# EasyEDA Pro project ProProject_【ART-Pi】【FOC】无刷电机驱动器ODrive-AP0.3_2024-06-29.epro, schematic 【ART-Pi】【FOC】无刷电机驱动器ODrive AP0.3_1

## Sheets
1 Controller
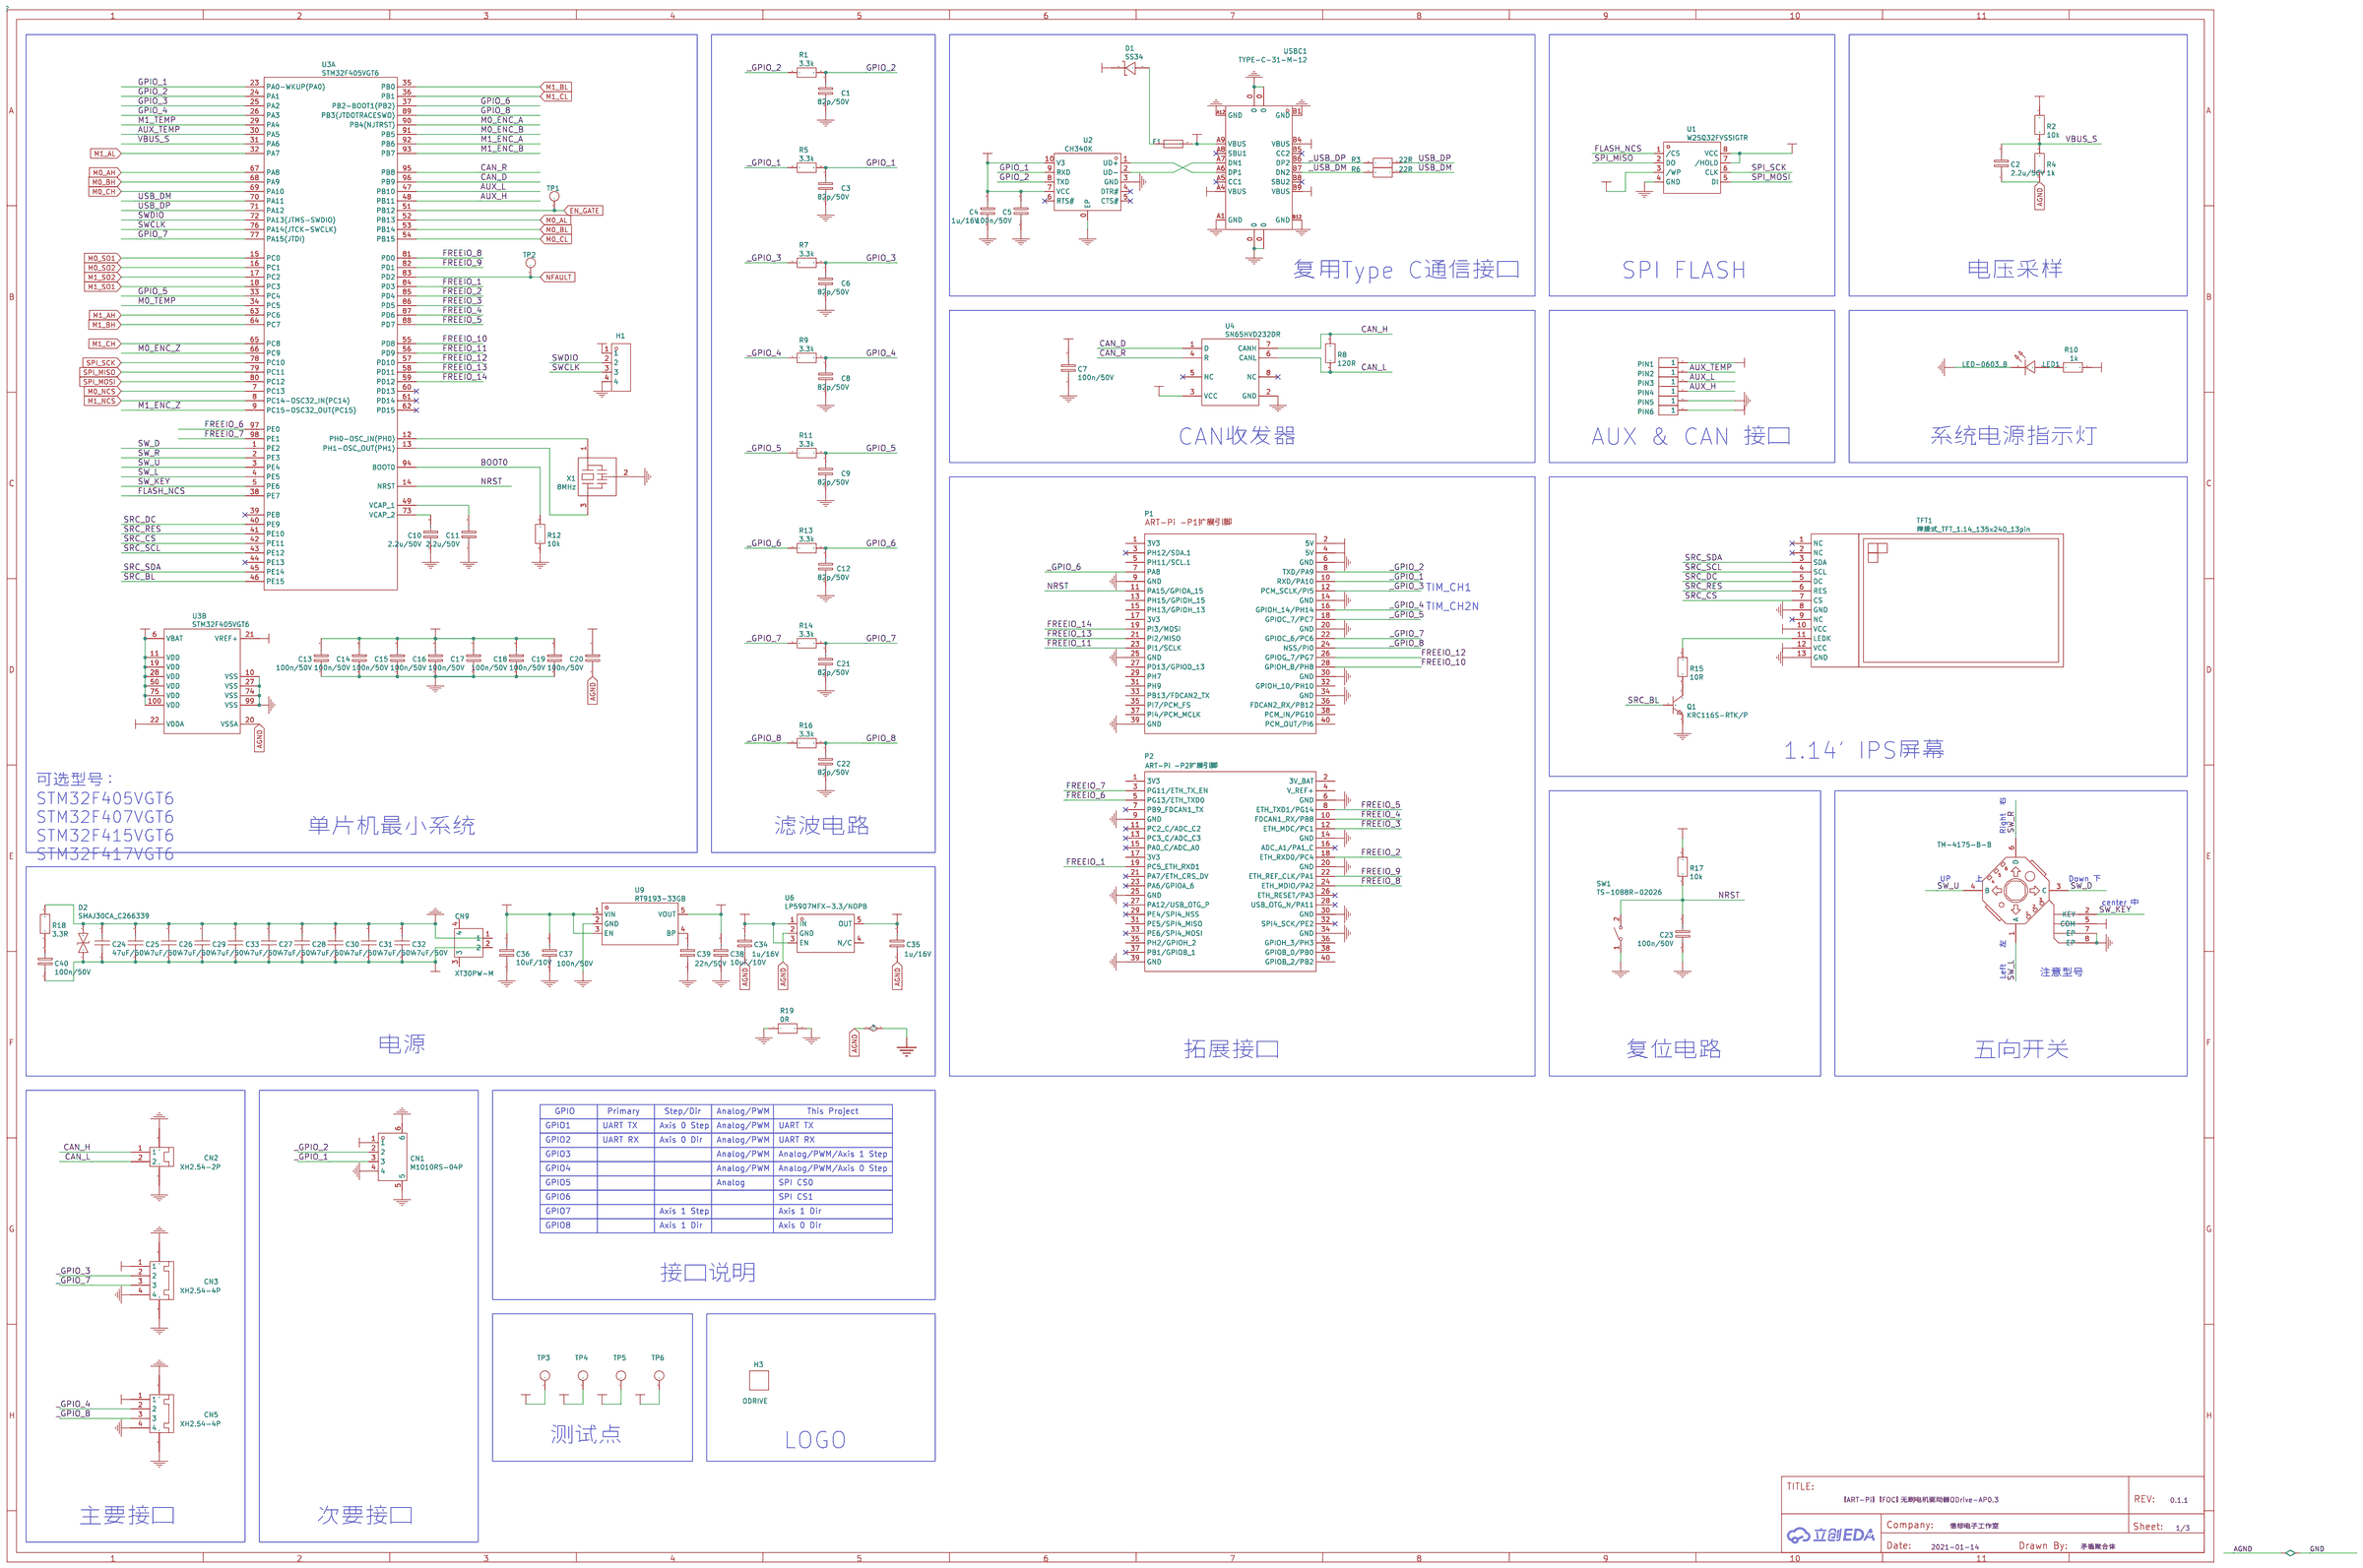
[diagram p3: Controller]
2 M0_Motor
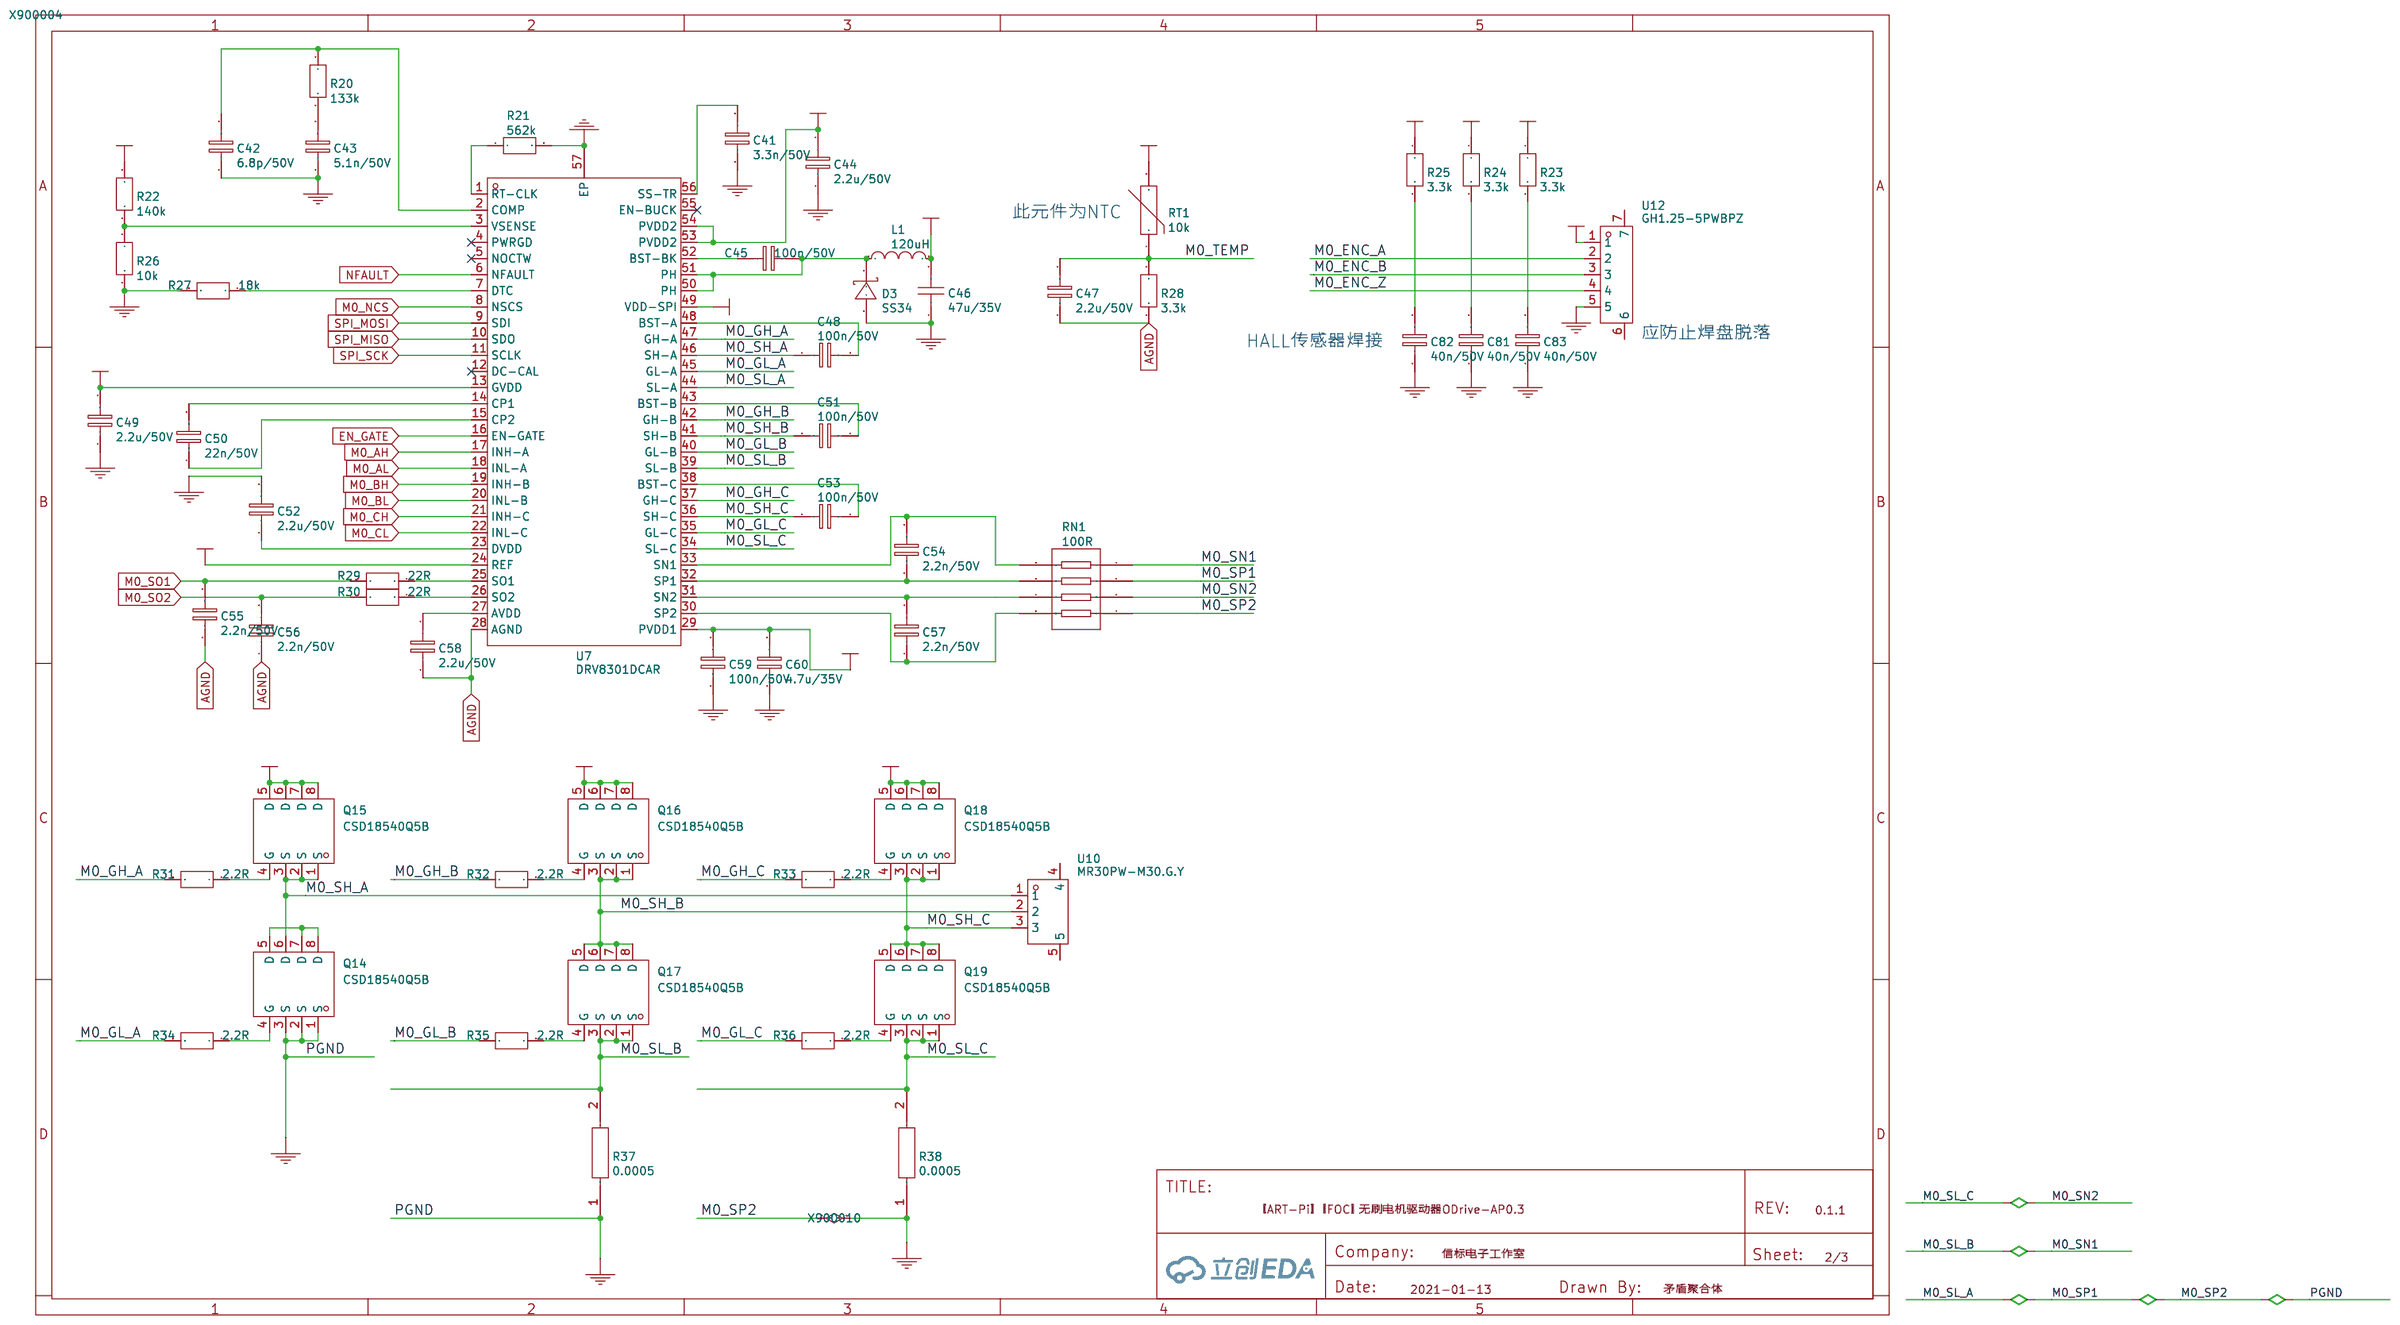
[diagram p4: M0_Motor]
3 M1_Motor
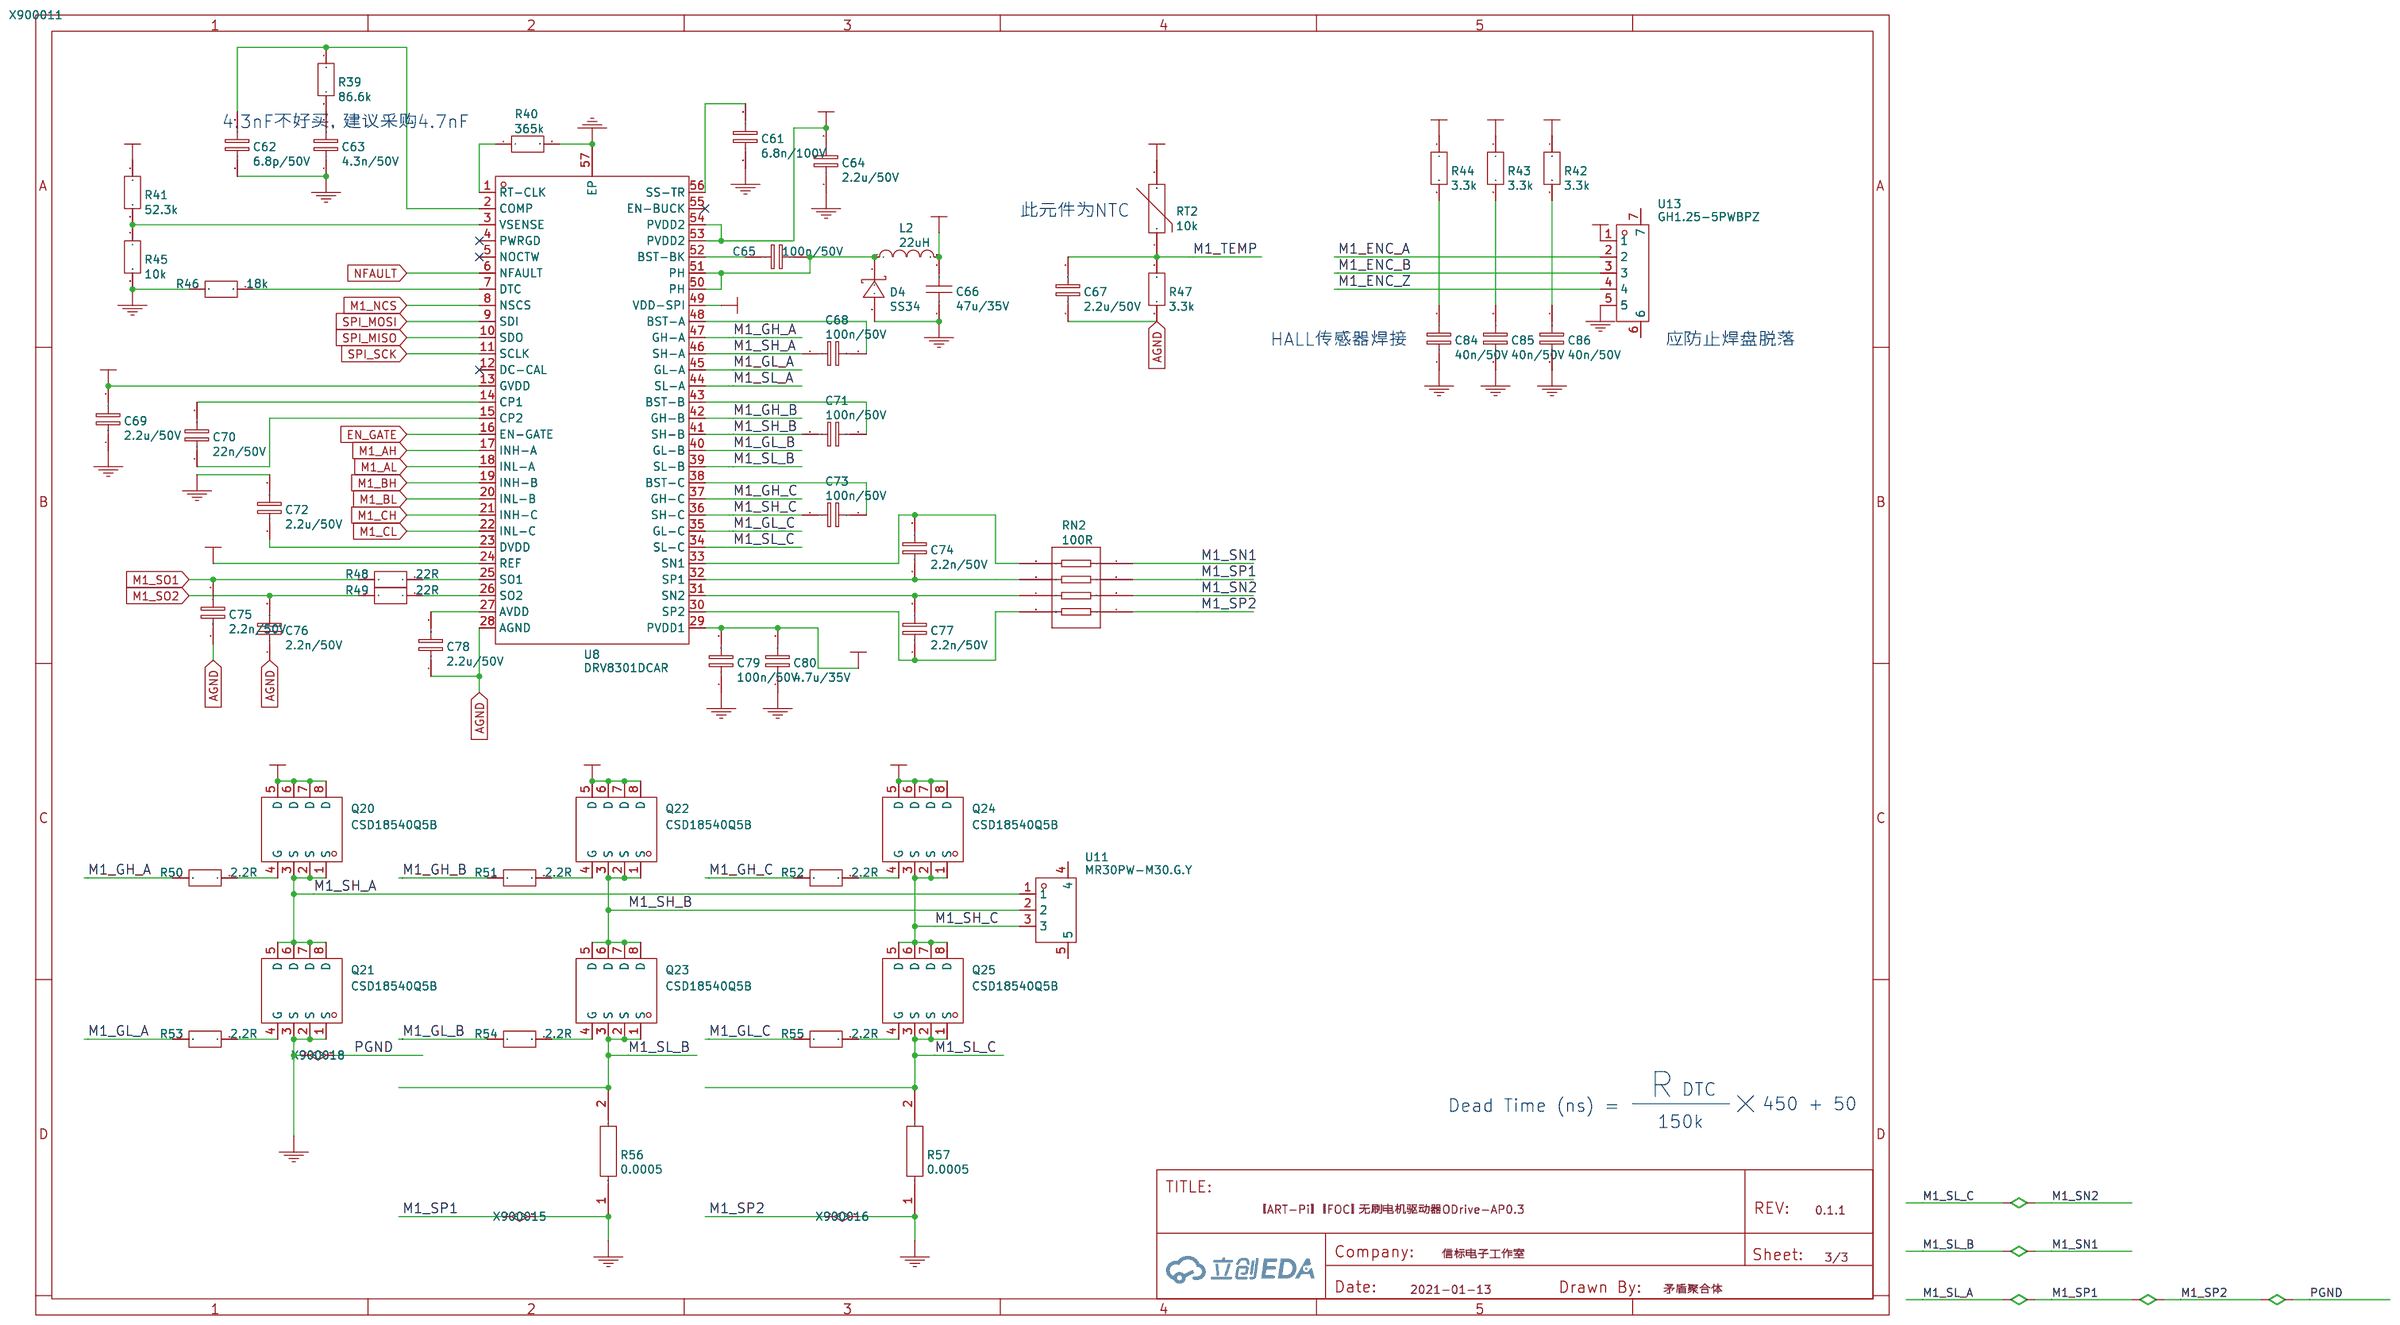
[diagram p5: M1_Motor]

## Parts
sheet Controller
C1  82p/50V  [C0603]
C2  2.2u/50V  [C0603]
C3  82p/50V  [C0603]
C4  1u/16V  [C0603]
C5  100n/50V  [C0603]
C6  82p/50V  [C0603]
C7  100n/50V  [C0603]
C8  82p/50V  [C0603]
C9  82p/50V  [C0603]
C10  2.2u/50V  [C0603]
C11  2.2u/50V  [C0603]
C12  82p/50V  [C0603]
C13  100n/50V  [C0603]
C14  100n/50V  [C0603]
C15  100n/50V  [C0603]
C16  100n/50V  [C0603]
C17  100n/50V  [C0603]
C18  100n/50V  [C0603]
C19  100n/50V  [C0603]
C20  100n/50V  [C0603]
C21  82p/50V  [C0603]
C22  82p/50V  [C0603]
C23  100n/50V  [C0603]
C24  47uF/50V  [C1812]
C25  47uF/50V  [C1812]
C26  47uF/50V  [C1812]
C27  47uF/50V  [C1812]
C28  47uF/50V  [C1812]
C29  47uF/50V  [C1812]
C30  47uF/50V  [C1812]
C31  47uF/50V  [C1812]
C32  47uF/50V  [C1812]
C33  47uF/50V  [C1812]
C34  1u/16V  [C0603]
C35  1u/16V  [C0603]
C36  10uF/10V  [C0603]
C37  100n/50V  [C0603]
C38  10uF/10V  [C0603]
C39  22n/50V  [C0603]
C40  100n/50V  [C0603]
CN1  M1010RS-04P  [CONN-SMD_M1010RS-04P]
CN2  XH2.54-2P  [CONN-SMD_2.54-2P-WT]
CN3  XH2.54-4P  [CONN-SMD_2.54-4P-WT]
CN5  XH2.54-4P  [CONN-SMD_2.54-4P-WT]
CN9  XT30PW-M  [CONN-TH_XT30PW-M]
D1  SS34  [SMA_L4.4-W2.8-LS5.4-RD]
D2  SMAJ30CA_C266339  [SMA_L4.4-W2.6-LS5.0-BI]
F1  FSMD012-1206-R  [F1206]
H1  PZ200V-11-04P  [HDR-TH_4P-P2.00-V-M]  (no BOM)
H3  ODRIVE  [ODRIVE_LOGO_H3.5]  (no BOM)
KEY  TM-4175-B-B  [SW-SMD_TM-4175-B-B]
LED1  LED-0603_B  [LED0603_BLUE]
P1  ART-Pi -P1扩展引脚  [MY_HDR-TH_40P-P2.54-V-M-R2-C20-S2.54]
P2  ART-Pi -P2扩展引脚  [MY_HDR-TH_40P-P2.54-V-M-R2-C20-S2.54]
PIN1  1PIN  [1PIN]  (no BOM)
PIN2  1PIN  [1PIN]  (no BOM)
PIN3  1PIN  [1PIN]  (no BOM)
PIN4  1PIN  [1PIN]  (no BOM)
PIN5  1PIN  [1PIN]  (no BOM)
PIN6  1PIN  [1PIN]  (no BOM)
Q1  KRC116S-RTK/P  [SOT-23-3_L2.9-W1.6-P1.90-LS2.8-BR]
R1  3.3k  [R0603]
R2  10k  [R0603]
R3  22R  [R0603]
R4  1k  [R0603]
R5  3.3k  [R0603]
R6  22R  [R0603]
R7  3.3k  [R0603]
R8  120R  [R0603]
R9  3.3k  [R0603]
R10  1k  [R0603]
R11  3.3k  [R0603]
R12  10k  [R0603]
R13  3.3k  [R0603]
R14  3.3k  [R0603]
R15  10R  [R0603]
R16  3.3k  [R0603]
R17  10k  [R0603]
R18  3.3R  [R0603]
R19  0R  [R0603]
SW1  TS-1088R-02026  [SW-SMD_L3.9-W3.0-P4.45]
TFT1  焊接式_TFT_1.14_135x240_13pin  [焊接式_TFT_1.14_135X240_13PIN]
TP1  Testpoint 1.6mm  [TESTPOINT 1.6MM]  (no BOM)
TP2  Testpoint 1.6mm  [TESTPOINT 1.6MM]  (no BOM)
TP3  Testpoint 1.6mm  [TESTPOINT 1.6MM]  (no BOM)
TP4  Testpoint 1.6mm  [TESTPOINT 1.6MM]  (no BOM)
TP5  Testpoint 1.6mm  [TESTPOINT 1.6MM]  (no BOM)
TP6  Testpoint 1.6mm  [TESTPOINT 1.6MM]  (no BOM)
U1  W25Q32FVSSIGTR  [SOIC-8_L5.3-W5.3-P1.27-LS8.0-BL]
U2  CH340K  [ESOP-10_L4.9-W3.9-P1.00-LS6.2-BL-EP]
U3  STM32F405VGT6  [LQFP-100_L14.0-W14.0-P0.50-LS16.0-BL]  (sections 1,2)
U4  SN65HVD232DR  [SOIC-8_L5.0-W4.0-P1.27-LS6.0-BL]
U6  LP5907MFX-3.3/NOPB  [SOT-23-5_L3.0-W1.7-P0.95-LS2.8-BR]
U9  RT9193-33GB  [SOT-23-5_L3.0-W1.7-P0.95-LS2.8-BR]
USBC1  TYPE-C-31-M-12  [USB-C_SMD-TYPE-C-31-M-12]
X1  8MHz  [OSC-SMD_3P-L3.2-W1.3-P1.2-L]
sheet M0_Motor
C41  3.3n/50V  [C0603]
C42  6.8p/50V  [C0603]
C43  5.1n/50V  [C0603]
C44  2.2u/50V  [C0603]
C45  100n/50V  [C0603]
C46  47u/35V  [C1812]
C47  2.2u/50V  [C0603]
C48  100n/50V  [C0603]
C49  2.2u/50V  [C0603]
C50  22n/50V  [C0603]
C51  100n/50V  [C0603]
C52  2.2u/50V  [C0603]
C53  100n/50V  [C0603]
C54  2.2n/50V  [C0603]
C55  2.2n/50V  [C0603]
C56  2.2n/50V  [C0603]
C57  2.2n/50V  [C0603]
C58  2.2u/50V  [C0603]
C59  100n/50V  [C0603]
C60  4.7u/35V  [C0603]
C81  40n/50V  [C0603]
C82  40n/50V  [C0603]
C83  40n/50V  [C0603]
D3  SS34  [SMA_L4.4-W2.8-LS5.4-RD]
L1  120uH  [IND-SMD_L6.0-W6.0]
Q14  CSD18540Q5B  [VSON-CLIP-8_L5.0-W6.0-P1.27-BL]
Q15  CSD18540Q5B  [VSON-CLIP-8_L5.0-W6.0-P1.27-BL]
Q16  CSD18540Q5B  [VSON-CLIP-8_L5.0-W6.0-P1.27-BL]
Q17  CSD18540Q5B  [VSON-CLIP-8_L5.0-W6.0-P1.27-BL]
Q18  CSD18540Q5B  [VSON-CLIP-8_L5.0-W6.0-P1.27-BL]
Q19  CSD18540Q5B  [VSON-CLIP-8_L5.0-W6.0-P1.27-BL]
R20  133k  [R0603]
R21  562k  [R0603]
R22  140k  [R0603]
R23  3.3k  [R0603]
R24  3.3k  [R0603]
R25  3.3k  [R0603]
R26  10k  [R0603]
R27  18k  [R0603]
R28  3.3k  [R0603]
R29  22R  [R0603]
R30  22R  [R0603]
R31  2.2R  [R0603]
R32  2.2R  [R0603]
R33  2.2R  [R0603]
R34  2.2R  [R0603]
R35  2.2R  [R0603]
R36  2.2R  [R0603]
R37  0.0005  [R2512]
R38  0.0005  [R2512]
RN1  100R  [RES-ARRAY-SMD_0603-8P-L3.2-W1.6-BL]
RT1  10k  [R0603]
U7  DRV8301DCAR  [HTSSOP-56_L14.0-W6.0-P0.50-LS8.0-BL]
U10  MR30PW-M30.G.Y  [CONN-TH_3P-P3.50_MR30PW-M30-G-Y]
U12  GH1.25-5PWBPZ  [CONN-SMD_5P-P1.25_GH1.25-5PWBPZ]
sheet M1_Motor
C61  6.8n/100V  [C0603]
C62  6.8p/50V  [C0603]
C63  4.3n/50V  [C0603]
C64  2.2u/50V  [C0603]
C65  100n/50V  [C0603]
C66  47u/35V  [C1812]
C67  2.2u/50V  [C0603]
C68  100n/50V  [C0603]
C69  2.2u/50V  [C0603]
C70  22n/50V  [C0603]
C71  100n/50V  [C0603]
C72  2.2u/50V  [C0603]
C73  100n/50V  [C0603]
C74  2.2n/50V  [C0603]
C75  2.2n/50V  [C0603]
C76  2.2n/50V  [C0603]
C77  2.2n/50V  [C0603]
C78  2.2u/50V  [C0603]
C79  100n/50V  [C0603]
C80  4.7u/35V  [C0603]
C84  40n/50V  [C0603]
C85  40n/50V  [C0603]
C86  40n/50V  [C0603]
D4  SS34  [SMA_L4.4-W2.8-LS5.4-RD]
L2  22uH  [IND-SMD_L6.0-W6.0]
Q20  CSD18540Q5B  [VSON-CLIP-8_L5.0-W6.0-P1.27-BL]
Q21  CSD18540Q5B  [VSON-CLIP-8_L5.0-W6.0-P1.27-BL]
Q22  CSD18540Q5B  [VSON-CLIP-8_L5.0-W6.0-P1.27-BL]
Q23  CSD18540Q5B  [VSON-CLIP-8_L5.0-W6.0-P1.27-BL]
Q24  CSD18540Q5B  [VSON-CLIP-8_L5.0-W6.0-P1.27-BL]
Q25  CSD18540Q5B  [VSON-CLIP-8_L5.0-W6.0-P1.27-BL]
R39  86.6k  [R0603]
R40  365k  [R0603]
R41  52.3k  [R0603]
R42  3.3k  [R0603]
R43  3.3k  [R0603]
R44  3.3k  [R0603]
R45  10k  [R0603]
R46  18k  [R0603]
R47  3.3k  [R0603]
R48  22R  [R0603]
R49  22R  [R0603]
R50  2.2R  [R0603]
R51  2.2R  [R0603]
R52  2.2R  [R0603]
R53  2.2R  [R0603]
R54  2.2R  [R0603]
R55  2.2R  [R0603]
R56  0.0005  [R2512]
R57  0.0005  [R2512]
RN2  100R  [RES-ARRAY-SMD_0603-8P-L3.2-W1.6-BL]
RT2  10k  [R0603]
U8  DRV8301DCAR  [HTSSOP-56_L14.0-W6.0-P0.50-LS8.0-BL]
U11  MR30PW-M30.G.Y  [CONN-TH_3P-P3.50_MR30PW-M30-G-Y]
U13  GH1.25-5PWBPZ  [CONN-SMD_5P-P1.25_GH1.25-5PWBPZ]

## Library data of the parts
C1 C3 C6 C8 C9 C12 C21 C22 = 82p/50V: Manufacturer Part: CC0603GRNPO0BN820; Supplier: LCSC; Manufacturer: YAGEO; Supplier Part: C576792
C2 C44 C47 C49 C52 C58 C64 C67 C69 C72 C78 = 2.2u/50V: Manufacturer Part: GRM188R61H225KE11D; Supplier Part: C162273; Manufacturer: Murata Electronics; Supplier: LCSC
C4 = 1u/16V: Manufacturer Part: CL10A105KO8NNNC; Supplier: LCSC; Manufacturer: SAMSUNG; Supplier Part: C1592
C5 C13-C20 C23 = 100n/50V: Manufacturer Part: CC0603KRX7R9BB104; Supplier: LCSC; Manufacturer: YAGEO; Supplier Part: C14663
C7 C37 C40 = 100n/50V: Supplier Part: C14663; Supplier: LCSC; Manufacturer Part: CC0603KRX7R9BB104; Manufacturer: YAGEO
C10 C11 = 2.2u/50V: Manufacturer Part: GRM188R61H225KE11D; Supplier: LCSC; Manufacturer: Murata Electronics; Supplier Part: C162273
C24-C33 = 47uF/50V
C34 C35 = 1u/16V: Supplier Part: C1592; Supplier: LCSC; Manufacturer Part: CL10A105KO8NNNC; Manufacturer: SAMSUNG
C36 C38 = 10uF/10V: Supplier Part: C85713; Supplier: LCSC; Manufacturer Part: CL10A106MP8NNNC; Manufacturer: SAMSUNG
C39 = 22n/50V: Supplier Part: C21122; Supplier: LCSC; Manufacturer Part: CL10B223KB8NNNC; Manufacturer: SAMSUNG
CN1 = M1010RS-04P: Supplier: LCSC; Supplier Part: C541846; Manufacturer: XFCN
CN2 = XH2.54-2P: Supplier: LCSC; Manufacturer: BOOMELE; Manufacturer Part: XH-5AW; image: //image.lceda.cn/szlcsc/C24023.jpg; Supplier Part: C24023; Paste Type: expand; Assembly Type: manualWeld
CN3 CN5 = XH2.54-4P: Supplier: LCSC; Manufacturer: BOOMELE; Manufacturer Part: XH-5AW; image: //image.lceda.cn/szlcsc/C24023.jpg; Supplier Part: C24023; Paste Type: expand; Assembly Type: manualWeld
CN9 = XT30PW-M: 类别:-;类型1:-;; LCSC Part Name: AMASS(艾迈斯)航模插头 卧式弯脚 XT30PW-M公头; Supplier Part: C431092; Manufacturer: AMASS(艾迈斯); JLCPCB Part Class: 扩展库; Datasheet: https://atta.szlcsc.com/upload/public/pdf/source/20220222/6A9F22F7850E25B33E1BE430ADF8560B.pdf; Supplier: LCSC; Brand: 艾迈斯; Type: 航模插头; RatedVoltage: DC 500V; InterfaceType: 公头; RatedCurrent: 15A; RecommendedWireGauge: 16/18/20AWG; contact resistance: 1.2mΩ; specifications: 2pin
D1 D3 D4 = SS34: Supplier: LCSC; Manufacturer: Yenji; Supplier Part: C142458
D2 = SMAJ30CA_C266339: Supplier: LCSC; Supplier Part: C266339; Manufacturer: Suzhou Good-Ark Elec; Manufacturer Part: SMAJ30CA
F1 = FSMD012-1206-R: Supplier: LCSC; Supplier Part: C220144; Manufacturer: Fuzetec Tech; JLCPCB Part Class: Extend
H1 = PZ200V-11-04P: Supplier: LCSC; Supplier Part: C541858; Manufacturer: XFCN; JLCPCB SMD: Yes; JLCPCB Part Class: Extend
H3 = ODRIVE: Manufacturer Part: Hole-3mm
KEY = TM-4175-B-B: Supplier: LCSC; Manufacturer: HRO; Manufacturer Part: K1-5202UA-01; Supplier Part: C465996
LED1 = LED-0603_B: Manufacturer: EVERLIGHT(台湾亿光); Manufacturer Part: 19-217/BHC-ZL1M2RY/3T; Supplier Part: C72041; Supplier: LCSC
P1 = ART-Pi -P1扩展引脚: Manufacturer: BOOMELE; Manufacturer Part: 2.54mm 2*20PFemale header; Supplier Part: C50982; Supplier: LCSC
P2 = ART-Pi -P2扩展引脚: Manufacturer: BOOMELE; Manufacturer Part: 2.54mm 2*20PFemale header; Supplier Part: C50982; Supplier: LCSC
PIN1-PIN6 = 1PIN
Q1 = KRC116S-RTK/P: Supplier: LCSC; Supplier Part: C125283; Manufacturer: KEC Semicon; JLCPCB Part Class: Extend; JLCPCB SMD: Yes
R1 R5 R7 R9 R11 R13 R14 R16 R23-R25 R28 R42-R44 R47 = 3.3k: Manufacturer Part: 0603WAF3301T5E; Supplier: LCSC; Manufacturer: UniOhm; Supplier Part: C22978
R2 R12 R17 R26 R45 = 10k: Manufacturer Part: RC0603FR-0710KL; Supplier: LCSC; Manufacturer: YAGEO; Supplier Part: C98220
R3 R6 R29 R30 R48 R49 = 22R: Manufacturer Part: ARG03FTC0220; Supplier: LCSC; Manufacturer: Viking Tech; Supplier Part: C217888
R4 R10 = 1k: Manufacturer Part: RT0603FRE071KL; Supplier: LCSC; Manufacturer: YAGEO; Supplier Part: C375503
R8 = 120R: Manufacturer Part: HPCR0603F120RK9; Supplier: LCSC; Manufacturer: ResistorToday; Supplier Part: C365072
R15 = 10R: Manufacturer Part: QR0603J10RP05; Supplier: LCSC; Manufacturer: Ever Ohms Tech; Supplier Part: C176153
R18 = 3.3R: Manufacturer Part: 1206W4F330KT5E; Supplier: LCSC; Manufacturer: UniOhm; Supplier Part: C17945
R19 = 0R: Manufacturer Part: 0603WAJ0000T5E; Supplier: LCSC; Manufacturer: UniOhm; Supplier Part: C15402
SW1 = TS-1088R-02026: Supplier: LCSC; Supplier Part: C455280; Manufacturer: XUNPU; JLCPCB SMD: Yes; JLCPCB Part Class: Extend
TFT1 = 焊接式_TFT_1.14_135x240_13pin
TP1-TP6 = Testpoint 1.6mm
U1 = W25Q32FVSSIGTR: Supplier: LCSC; Manufacturer: WINBOND; Manufacturer Part: W25Q32JVSSIQ; Supplier Part: C82344
U2 = CH340K: Supplier: LCSC; Supplier Part: C968586; Manufacturer: WCH(Jiangsu Qin Heng)
U3 = STM32F405VGT6: tags: STM32; Supplier Part: C56621; Supplier: LCSC; Manufacturer: ST; image: http://image.lceda.cn/szlcsc/C56621.jpg
U4 = SN65HVD232DR: Supplier: LCSC; Manufacturer: TI; image: //image.lceda.cn/szlcsc/C30530.jpg; Supplier Part: C30530; JLCPCB Part Class: Extend; JLCPCB SMD: Yes
U6 = LP5907MFX-3.3/NOPB: Supplier: LCSC; Supplier Part: C80670; Manufacturer: Texas Instruments; JLCPCB Part Class: Extend; JLCPCB SMD: Yes
U9 = RT9193-33GB: Supplier: LCSC; Manufacturer: RICHTEK; Supplier Part: C15651; Paste Type: expand
USBC1 = TYPE-C-31-M-12: Supplier: LCSC; Supplier Part: C165948; Manufacturer: Rectangular Connectors - Contacts
X1 = 8MHz: Supplier: LCSC; Manufacturer: MuRata; Manufacturer Part: CSTCE8M00G52-R0; Supplier Part: C22549
C41 = 3.3n/50V: Manufacturer Part: 0603B332K500NT; Supplier Part: C92203; Manufacturer: FH; Supplier: LCSC
C42 C62 = 6.8p/50V: Manufacturer Part: 0603CG6R8C500NT; Supplier Part: C1679; Manufacturer: FH; Supplier: LCSC
C43 = 5.1n/50V: Manufacturer Part: 0603B512K500NT; Supplier Part: C1587; Manufacturer: FH; Supplier: LCSC
C45 C48 C51 C53 C59 C65 C68 C71 C73 C79 = 100n/50V: Manufacturer Part: CC0603KRX7R9BB104; Supplier Part: C14663; Manufacturer: YAGEO; Supplier: LCSC
C46 C66 = 47u/35V
C50 C70 = 22n/50V: Manufacturer Part: CL10B223KB8NNNC; Supplier Part: C21122; Manufacturer: SAMSUNG; Supplier: LCSC
C54-C57 C74-C77 = 2.2n/50V: Manufacturer Part: 0603B222K500NT; Supplier Part: C1604; Manufacturer: FH; Supplier: LCSC
C60 C80 = 4.7u/35V: Manufacturer Part: CL10A475KL8NRNC; Supplier Part: C307467; Manufacturer: Samsung Electro-Mechanics; Supplier: LCSC
C81-C86 = 40n/50V: Manufacturer Part: 0603B403K500NT; Supplier Part: C41782; Manufacturer: FH; Supplier: LCSC
L1 = 120uH: Supplier: LCSC; Supplier Part: C168096; Manufacturer: Changjiang Microelectronics Tech; Manufacturer Part: FNR6045S121MT
Q14-Q25 = CSD18540Q5B: 类型:1个N沟道;漏源电压(Vdss):60V;连续漏极电流(Id):100A;功率(Pd):3.1W；195W;导通电阻(RDS(on)@Vgs,Id):2.2mΩ@10V,28A;阈值电压(Vgs(th)@Id):2.3V@250uA;; LCSC Part Name: 1个N沟道 耐压:60V 电流:100A; Supplier Part: C86513; Manufacturer: TI(德州仪器); Supplier Footprint: VSON-8(5x6); JLCPCB Part Class: 扩展库; Datasheet: https://www.ti.com/cn/lit/gpn/csd18540q5b; Supplier: LCSC; Type: 1个N沟道; Drain Source Voltage (Vdss): 60V; Continuous Drain Current (Id): 100A; Power Dissipation (Pd): 3.1W；195W; Drain Source On Resistance (RDS(on)@Vgs,Id): 2.2mΩ@10V,28A; Gate Threshold Voltage (Vgs(th)@Id): 2.3V@250uA; Total Gate Charge (Qg@Vgs): 53nC@10V; Input Capacitance (Ciss@Vds): 4.23nF@30V; Operating Temperature: -55℃~+150℃@(Tj)
R20 = 133k: Manufacturer Part: AC0603FR-07133KL; Supplier: LCSC; Manufacturer: YAGEO; Supplier Part: C227577
R21 = 562k: Manufacturer Part: TC0325D5623T5E; Supplier: LCSC; Manufacturer: UniOhm; Supplier Part: C51262
R22 = 140k: Manufacturer Part: RC0603FR-07140KL; Supplier: LCSC; Manufacturer: YAGEO; Supplier Part: C185372
R27 R46 = 18k: Manufacturer Part: ARG03FTC1802; Supplier: LCSC; Manufacturer: Viking Tech; Supplier Part: C217831
R31-R36 R50-R55 = 2.2R: Manufacturer Part: 0603WAJ022JT5E; Supplier: LCSC; Manufacturer: UniOhm; Supplier Part: C25226
R37 R38 R56 R57 = 0.0005: Supplier: LCSC; Supplier Part: C2681067; Manufacturer: RALEC(旺诠); Manufacturer Part: LR2512-23R0005J4
RN1 RN2 = 100R: Supplier: LCSC; Manufacturer: FH; Manufacturer Part: RC-ML08W101JT; Supplier Part: C79203
RT1 RT2 = 10k: Supplier: LCSC; Supplier Part: C524451; Manufacturer: TDK; Manufacturer Part: NTCG164BH103JT1
U7 U8 = DRV8301DCAR: Supplier: LCSC; Supplier Part: C98969; Manufacturer: Texas Instruments; JLCPCB Part Class: Extend; JLCPCB SMD: Yes
U10 U11 = MR30PW-M30.G.Y: LCSC Part Name: MR30PW20三芯PCB 弯插公金黄H=3mm; Supplier Part: C19268036; Manufacturer: AMASS(艾迈斯); JLCPCB Part Class: 扩展库; Datasheet: https://atta.szlcsc.com/upload/public/pdf/source/20231221/E63D24EDC016665263C6304FABBAAC61.pdf; Supplier: LCSC
U12 U13 = GH1.25-5PWBPZ: LCSC Part Name: GH1.25-5P卧贴编带; Supplier Part: C2829254; Manufacturer: BOOMELE(博穆精密); JLCPCB Part Class: 扩展库; Datasheet: https://atta.szlcsc.com/upload/public/pdf/source/20211125/08A09A4909F58AF780B71FE423A00F7E.pdf; Supplier: LCSC
C61 = 6.8n/100V: Manufacturer Part: 0603B682K101NT; Supplier Part: C81355; Manufacturer: FH; Supplier: LCSC
C63 = 4.3n/50V: Manufacturer Part: CC0603KRX7R9BB472; Supplier Part: C106218; Manufacturer: YAGEO; Supplier: LCSC
L2 = 22uH: Supplier: LCSC; Supplier Part: C51349; Manufacturer: Sunlord; Manufacturer Part: SWPA6028S220MT
R39 = 86.6k: Manufacturer Part: RM06FTN8662; Supplier: LCSC; Manufacturer: TA-I Tech; Supplier Part: C188033
R40 = 365k: Manufacturer Part: RC0603FR-07365KL; Supplier: LCSC; Manufacturer: YAGEO; Supplier Part: C185336
R41 = 52.3k: Manufacturer Part: RMC060352.3K1%N; Supplier: LCSC; Manufacturer: Tyohm; Supplier Part: C325624

## Nets
5V: C34.2 C36.2 C37.2 C66.2 CN3.1 CN5.1 D1.1(K) L2.2 P1.2(5V) P1.4(5V) R41.1 TP5.1 U6.1(IN) U6.3(EN) U9.1(VIN) U9.3(EN)
12V: C46.2 L1.2 PIN1.1 R22.1 TP6.1
AVCC: C20.2 C35.2 PIN6.1 RT1.2 RT2.2 TP4.1 U3.21(VREF+) U3.22(VDDA) U6.5(OUT) U7.24(REF) U8.24(REF)
GND: C1.2 C2.1 C3.2 C4.1 C5.1 C6.2 C7.1 C8.2 C9.2 C10.1 C11.1 C12.2 C13.1 C14.1 C15.1 C16.1 C17.1 C18.1 C19.1 C20.1 C21.2 C22.2 C23.1 C34.1 C35.1 C36.1 C37.1 C38.1 C39.1 C42.1 C43.1 C46.1 C47.1 C49.1 C52.2 C55.1 C56.1 C58.1 C62.1 C63.1 C66.1 C67.1 C69.1 C72.2 C75.1 C76.1 C78.1 C81.1 C82.1 C83.1 C84.1 C85.1 C86.1 CN1.4 CN1.5 CN1.6 CN2.0 CN3.0 CN3.4 CN5.0 CN5.4 D3.2(A) D4.2(A) H1.4 KEY.7(EP) KEY.8(EP) LED1.2 P1.6(GND) P1.9(GND) P1.14(GND) P1.20(GND) P1.25(GND) P1.30(GND) P1.34(GND) P1.39(GND) P2.6(GND) P2.9(GND) P2.14(GND) P2.20(GND) P2.25(GND) P2.30(GND) P2.34(GND) P2.39(GND) PIN5.1 Q1.2(E) R4.2 R12.2 R19.2 R21.2 R26.2 R27.2 R28.2 R40.2 R45.2 R46.2 R47.2 SW1.1 TFT1.8(GND) TFT1.13(GND) U1.4(GND) U2.0(EP) U2.3(GND) U3.10(VSS) U3.20(VSSA) U3.27(VSS) U3.74(VSS) U3.99(VSS) U4.2(GND) U6.2(GND) U7.28(AGND) U7.57(EP) U8.28(AGND) U8.57(EP) U9.2(GND) U12.5 U13.5 USBC1.0 USBC1.A1(GND) USBC1.A12(GND) USBC1.B1(GND) USBC1.B12(GND) X1.2(VSS)
PGND: C24.2 C25.2 C26.2 C27.2 C28.2 C29.2 C30.2 C31.2 C32.2 C33.2 C41.1 C44.1 C59.1 C60.1 C61.1 C64.1 C79.1 C80.1 CN9.1 D2.2 Q14.1(S) Q14.2(S) Q14.3(S) Q21.1(S) Q21.2(S) Q21.3(S) R18.1 R19.1 R37.1 R38.1 R56.1 R57.1 RN1.1 RN1.3 RN2.1 RN2.3 U7.44(SL-A) U8.44(SL-A)
VBUS_S: C2.2 R2.2 R4.1 U3.31(PA6)
VCC: C4.2 C5.2 C7.2 C13.2 C14.2 C15.2 C16.2 C17.2 C18.2 C19.2 C38.2 CN1.1 H1.1 KEY.5(COM) R10.1 R17.1 R23.1 R24.1 R25.1 R42.1 R43.1 R44.1 TFT1.10(VCC) TFT1.12(VCC) TP3.1 U1.3(/WP) U1.7(/HOLD) U1.8(VCC) U2.7(VCC) U2.10(V3) U3.6(VBAT) U3.11(VDD) U3.19(VDD) U3.28(VDD) U3.50(VDD) U3.75(VDD) U3.100(VDD) U4.3(VCC) U7.49(VDD-SPI) U8.49(VDD-SPI) U9.5(VOUT) U12.1 U13.1
_GPIO_1: CN1.3 P1.10(RXD/PA10) R5.1
_GPIO_2: CN1.2 P1.8(TXD/PA9) R1.1
_GPIO_3: CN3.2 P1.12(PCM_SCLK/PI5) R7.1
_GPIO_4: CN5.2 P1.16(GPIOH_14/PH14) R9.1
_GPIO_5: P1.18(GPIOC_7/PC7) R11.1
_GPIO_6: P1.7(PA8) R13.1
_GPIO_7: CN3.3 P1.22(GPIOC_6/PC6) R14.1
_GPIO_8: CN5.3 P1.24(NSS/PI0) R16.1
_USB_DM: R6.2 USBC1.B7(DN2)
_USB_DP: R3.2 USBC1.B6(DP2)
AUX_H: PIN4.1 U3.48(PB11)
AUX_L: PIN3.1 U3.47(PB10)
AUX_TEMP: PIN2.1 U3.30(PA5)
BOOT0: R12.1 U3.94(BOOT0)
CAN_D: U3.96(PB9) U4.1(D)
CAN_H: CN2.1 R8.1 U4.7(CANH)
CAN_L: CN2.2 R8.2 U4.6(CANL)
CAN_R: U3.95(PB8) U4.4(R)
DCBUS: C24.1 C25.1 C26.1 C27.1 C28.1 C29.1 C30.1 C31.1 C32.1 C33.1 C40.2 C44.2 C59.2 C60.2 C64.2 C79.2 C80.2 CN9.2 D2.1 Q15.5(D) Q15.6(D) Q15.7(D) Q15.8(D) Q16.5(D) Q16.6(D) Q16.7(D) Q16.8(D) Q18.5(D) Q18.6(D) Q18.7(D) Q18.8(D) Q20.5(D) Q20.6(D) Q20.7(D) Q20.8(D) Q22.5(D) Q22.6(D) Q22.7(D) Q22.8(D) Q24.5(D) Q24.6(D) Q24.7(D) Q24.8(D) R2.1 U7.29(PVDD1) U7.53(PVDD2) U7.54(PVDD2) U8.29(PVDD1) U8.53(PVDD2) U8.54(PVDD2)
EN_GATE: TP1.1 U3.51(PB12) U7.16(EN-GATE) U8.16(EN-GATE)
FLASH_NCS: U1.1(/CS) U3.38(PE7)
FREEIO_1: P2.19(PC5_ETH_RXD1) U3.84(PD3)
FREEIO_2: P2.18(ETH_RXD0/PC4) U3.85(PD4)
FREEIO_3: P2.12(ETH_MDC/PC1) U3.86(PD5)
FREEIO_4: P2.10(FDCAN1_RX/PB8) U3.87(PD6)
FREEIO_5: P2.8(ETH_TXD1/PG14) U3.88(PD7)
FREEIO_6: P2.5(PG13/ETH_TXD0) U3.97(PE0)
FREEIO_7: P2.3(PG11/ETH_TX_EN) U3.98(PE1)
FREEIO_8: P2.24(ETH_MDIO/PA2) U3.81(PD0)
FREEIO_9: P2.22(ETH_REF_CLK/PA1) U3.82(PD1)
FREEIO_10: P1.28(GPIOH_8/PH8) U3.55(PD8)
FREEIO_11: P1.23(PI1/SCLK) U3.56(PD9)
FREEIO_12: P1.26(GPIOG_7/PG7) U3.57(PD10)
FREEIO_13: P1.21(PI2/MISO) U3.58(PD11)
FREEIO_14: P1.19(PI3/MOSI) U3.59(PD12)
GPIO_1: C3.1 R5.2 U2.9(RXD) U3.23(PA0-WKUP(PA0))
GPIO_2: C1.1 R1.2 U2.8(TXD) U3.24(PA1)
GPIO_3: C6.1 R7.2 U3.25(PA2)
GPIO_4: C8.1 R9.2 U3.26(PA3)
GPIO_5: C9.1 R11.2 U3.33(PC4)
GPIO_6: C12.1 R13.2 U3.37(PB2-BOOT1(PB2))
GPIO_7: C21.1 R14.2 U3.77(PA15(JTDI))
GPIO_8: C22.1 R16.2 U3.89(PB3(JTDOTRACESWO))
GVDD: C49.2 U7.13(GVDD)
GVDD2: C69.2 U8.13(GVDD)
M0_AH: U3.67(PA8) U7.17(INH-A)
M0_AL: U3.52(PB13) U7.18(INL-A)
M0_BH: U3.68(PA9) U7.19(INH-B)
M0_BL: U3.53(PB14) U7.20(INL-B)
M0_CH: U3.69(PA10) U7.21(INH-C)
M0_CL: U3.54(PB15) U7.22(INL-C)
M0_ENC_A: C83.2 R23.2 U3.90(PB4(NJTRST)) U12.2
M0_ENC_B: C81.2 R24.2 U3.91(PB5) U12.3
M0_ENC_Z: C82.2 R25.2 U3.66(PC9) U12.4
M0_GH_A: R31.2 U7.47(GH-A)
M0_GH_B: R32.2 U7.42(GH-B)
M0_GH_C: R33.2 U7.37(GH-C)
M0_GL_A: R34.2 U7.45(GL-A)
M0_GL_B: R35.2 U7.40(GL-B)
M0_GL_C: R36.2 U7.35(GL-C)
M0_NCS: U3.7(PC13) U7.8(NSCS)
M0_SH_A: C48.1 Q14.5(D) Q14.6(D) Q14.7(D) Q14.8(D) Q15.1(S) Q15.2(S) Q15.3(S) U7.46(SH-A) U10.1
M0_SH_B: C51.1 Q16.1(S) Q16.2(S) Q16.3(S) Q17.5(D) Q17.6(D) Q17.7(D) Q17.8(D) U7.41(SH-B) U10.2
M0_SH_C: C53.1 Q18.1(S) Q18.2(S) Q18.3(S) Q19.5(D) Q19.6(D) Q19.7(D) Q19.8(D) U7.36(SH-C) U10.3
M0_SL_B: Q17.1(S) Q17.2(S) Q17.3(S) R37.2 RN1.4 U7.39(SL-B)
M0_SL_C: Q19.1(S) Q19.2(S) Q19.3(S) R38.2 RN1.2 U7.34(SL-C)
M0_SO1: C55.2 R29.2 U3.15(PC0)
M0_SO2: C56.2 R30.2 U3.16(PC1)
M0_TEMP: C47.2 R28.1 RT1.1 U3.34(PC5)
M1_AH: U3.63(PC6) U8.17(INH-A)
M1_AL: U3.32(PA7) U8.18(INL-A)
M1_BH: U3.64(PC7) U8.19(INH-B)
M1_BL: U3.35(PB0) U8.20(INL-B)
M1_CH: U3.65(PC8) U8.21(INH-C)
M1_CL: U3.36(PB1) U8.22(INL-C)
M1_ENC_A: C86.2 R42.2 U3.92(PB6) U13.2
M1_ENC_B: C85.2 R43.2 U3.93(PB7) U13.3
M1_ENC_Z: C84.2 R44.2 U3.9(PC15-OSC32_OUT(PC15)) U13.4
M1_GH_A: R50.2 U8.47(GH-A)
M1_GH_B: R51.2 U8.42(GH-B)
M1_GH_C: R52.2 U8.37(GH-C)
M1_GL_A: R53.2 U8.45(GL-A)
M1_GL_B: R54.2 U8.40(GL-B)
M1_GL_C: R55.2 U8.35(GL-C)
M1_NCS: U3.8(PC14-OSC32_IN(PC14)) U8.8(NSCS)
M1_SH_A: C68.1 Q20.1(S) Q20.2(S) Q20.3(S) Q21.5(D) Q21.6(D) Q21.7(D) Q21.8(D) U8.46(SH-A) U11.1
M1_SH_B: C71.1 Q22.1(S) Q22.2(S) Q22.3(S) Q23.5(D) Q23.6(D) Q23.7(D) Q23.8(D) U8.41(SH-B) U11.2
M1_SH_C: C73.1 Q24.1(S) Q24.2(S) Q24.3(S) Q25.5(D) Q25.6(D) Q25.7(D) Q25.8(D) U8.36(SH-C) U11.3
M1_SL_B: Q23.1(S) Q23.2(S) Q23.3(S) R56.2 RN2.4 U8.39(SL-B)
M1_SL_C: Q25.1(S) Q25.2(S) Q25.3(S) R57.2 RN2.2 U8.34(SL-C)
M1_SO1: C75.2 R48.2 U3.18(PC3)
M1_SO2: C76.2 R49.2 U3.17(PC2)
M1_TEMP: C67.2 R47.1 RT2.1 U3.29(PA4)
NFAULT: TP2.1 U3.83(PD2) U7.6(NFAULT) U8.6(NFAULT)
NRST: C23.2 P1.11(PA15/GPIOA_15) R17.2 SW1.2 U3.14(NRST)
SPI_MISO: U1.2(DO) U3.79(PC11) U7.10(SDO) U8.10(SDO)
SPI_MOSI: U1.5(DI) U3.80(PC12) U7.9(SDI) U8.9(SDI)
SPI_SCK: U1.6(CLK) U3.78(PC10) U7.11(SCLK) U8.11(SCLK)
SRC_BL: Q1.1(B) U3.46(PE15)
SRC_CS: TFT1.7(CS) U3.42(PE11)
SRC_DC: TFT1.5(DC) U3.40(PE9)
SRC_RES: TFT1.6(RES) U3.41(PE10)
SRC_SCL: TFT1.4(SCL) U3.43(PE12)
SRC_SDA: TFT1.3(SDA) U3.45(PE14)
SW_D: KEY.3(C) U3.1(PE2)
SW_KEY: KEY.2(KEY) U3.5(PE6)
SW_L: KEY.1(A) U3.4(PE5)
SW_R: KEY.6(D) U3.2(PE3)
SW_U: KEY.4(B) U3.3(PE4)
SWCLK: H1.3 U3.76(PA14(JTCK-SWCLK))
SWDIO: H1.2 U3.72(PA13(JTMS-SWDIO))
USB_DM: R6.1 U3.70(PA11)
USB_DP: R3.1 U3.71(PA12)
VUSB: F1.2 USBC1.A4(VBUS) USBC1.A9(VBUS) USBC1.B4(VBUS) USBC1.B9(VBUS)
$1N10: R15.2 TFT1.11(LEDK)
$1N24: D1.2(A) F1.1
$1N25: U2.1(UD+) USBC1.A6(DP1)
$1N26: U2.2(UD-) USBC1.A7(DN1)
$1N30: U3.12(PH0-OSC_IN(PH0)) X1.1
$1N31: U3.13(PH1-OSC_OUT(PH1)) X1.3
$1N32: LED1.1 R10.2
$1N34: C10.2 U3.73(VCAP_2)
$1N35: C11.2 U3.49(VCAP_1)
$1N2624: C39.2 U9.4(BP)
$1N2635: Q1.3(C) R15.1
$1N2708: C40.1 R18.2
$2N2: Q15.4(G) R31.1
$2N3: Q14.4(G) R34.1
$2N11: Q17.4(G) R35.1
$2N12: Q16.4(G) R32.1
$2N16: Q19.4(G) R36.1
$2N17: Q18.4(G) R33.1
$2N43: C48.2 U7.48(BST-A)
$2N44: C51.2 U7.43(BST-B)
$2N45: C53.2 U7.38(BST-C)
$2N46: C54.2 RN1.5 U7.33(SN1)
$2N47: C57.2 RN1.7 U7.31(SN2)
$2N48: C57.1 RN1.8 U7.30(SP2)
$2N51: C58.2 U7.27(AVDD)
$2N52: R29.1 U7.25(SO1)
$2N53: R30.1 U7.26(SO2)
$2N58: C52.1 U7.23(DVDD)
$2N67: C50.1 U7.15(CP2)
$2N68: C50.2 U7.14(CP1)
$2N75: R27.1 U7.7(DTC)
$2N77: R22.2 R26.1 U7.3(VSENSE)
$2N80: C42.2 R20.1 U7.2(COMP)
$2N81: R21.1 U7.1(RT-CLK)
$2N84: C45.1 U7.52(BST-BK)
$2N85: C45.2 D3.1(K) L1.1 U7.50(PH) U7.51(PH)
$2N95: C41.2 U7.56(SS-TR)
$2N96: C54.1 RN1.6 U7.32(SP1)
$2N924: C43.2 R20.2
$3N2: Q20.4(G) R50.1
$3N3: Q21.4(G) R53.1
$3N11: Q23.4(G) R54.1
$3N12: Q22.4(G) R51.1
$3N16: Q25.4(G) R55.1
$3N17: Q24.4(G) R52.1
$3N43: C68.2 U8.48(BST-A)
$3N44: C71.2 U8.43(BST-B)
$3N45: C73.2 U8.38(BST-C)
$3N46: C74.2 RN2.5 U8.33(SN1)
$3N47: C77.2 RN2.7 U8.31(SN2)
$3N51: C78.2 U8.27(AVDD)
$3N52: R48.1 U8.25(SO1)
$3N53: R49.1 U8.26(SO2)
$3N58: C72.1 U8.23(DVDD)
$3N67: C70.1 U8.15(CP2)
$3N68: C70.2 U8.14(CP1)
$3N75: R46.1 U8.7(DTC)
$3N77: R41.2 R45.1 U8.3(VSENSE)
$3N80: C62.2 R39.1 U8.2(COMP)
$3N81: R40.1 U8.1(RT-CLK)
$3N84: C65.1 U8.52(BST-BK)
$3N85: C65.2 D4.1(K) L2.1 U8.50(PH) U8.51(PH)
$3N92: C61.2 U8.56(SS-TR)
$3N94: C77.1 RN2.8 U8.30(SP2)
$3N95: C74.1 RN2.6 U8.32(SP1)
$3N933: C63.2 R39.2

Not connected (* = marked no-connect by the designer): CN9 3 4; P1 1(3V3) 3(PH12/SDA.1)* 5(PH11/SCL.1) 13(PH15/GPIOH_15) 15(PH13/GPIOH_13) 17(3V3) 27(PD13/GPIOD_13) 29(PH7) 31(PH9) 32(GPIOH_10/PH10) 33(PB13/FDCAN2_TX) 35(PI7/PCM_FS) 36(FDCAN2_RX/PB12) 37(PI4/PCM_MCLK) 38(PCM_IN/PG10) 40(PCM_OUT/PI6); P2 1(3V3) 2(3V_BAT) 4(V_REF+) 7(PB9_FDCAN1_TX)* 11(PC2_C/ADC_C2)* 13(PC3_C/ADC_C3)* 15(PA0_C/ADC_A0)* 16(ADC_A1/PA1_C)* 17(3V3) 21(PA7/ETH_CRS_DV)* 23(PA6/GPIOA_6)* 26(ETH_RESET/PA3)* 27(PA12/USB_OTG_P)* 28(USB_OTG_N/PA11)* 29(PE4/SPI4_NSS)* 31(PE5/SPI4_MISO) 32(SPI4_SCK/PE2)* 33(PE6/SPI4_MOSI)* 35(PH2/GPIOH_2) 36(GPIOH_3/PH3) 37(PB1/GPIOB_1)* 38(GPIOB_0/PB0) 40(GPIOB_2/PB2); TFT1 1(NC)* 2(NC)* 9(NC)*; U2 4(DTR#)* 5(CTS#)* 6(RTS#)*; U3 39(PE8)* 44(PE13)* 60(PD13)* 61(PD14)* 62(PD15)*; U4 5(NC)* 8(NC)*; U6 4(N/C); U7 4(PWRGD)* 5(NOCTW)* 12(DC-CAL)* 55(EN-BUCK)*; U8 4(PWRGD)* 5(NOCTW)* 12(DC-CAL)* 55(EN-BUCK)*; U10 4 5; U11 4 5; U12 6 7; U13 6 7; USBC1 A5(CC1)* A8(SBU1)* B5(CC2)* B8(SBU2)*

## Notes on the sheets
sheet 1
- 复用Type C通信接口
- SPI FLASH
- 电压采样
- CAN收发器
- AUX & CAN 接口
- 系统电源指示灯
- TIM_CH1
- TIM_CH2N
- 1.14' IPS屏幕
- 可选型号：
  STM32F405VGT6
  STM32F407VGT6
  STM32F415VGT6
  STM32F417VGT6
- Right  右
- 单片机最小系统
- 滤波电路
- UP      上
- Down 下
- center 中
- Left    左
- 注意型号
- 电源
- 拓展接口
- 复位电路
- 五向开关
- GPIO
- Primary
- Step/Dir
- Analog/PWM
- This Project
- GPIO1
- UART TX
- Axis 0 Step
- Analog/PWM
- UART TX
- GPIO2
- UART RX
- Axis 0 Dir
- Analog/PWM
- UART RX
- GPIO3
- Analog/PWM
- Analog/PWM/Axis 1 Step
- GPIO4
- Analog/PWM
- Analog/PWM/Axis 0 Step
- GPIO5
- Analog
- SPI CS0
- GPIO6
- SPI CS1
- GPIO7
- Axis 1 Step
- Axis 1 Dir
- GPIO8
- Axis 1 Dir
- Axis 0 Dir
- 接口说明
- 测试点
- LOGO
- 主要接口
- 次要接口
sheet 2
- 此元件为NTC
- 应防止焊盘脱落
- HALL传感器焊接
sheet 3
- 4.3nF不好买，建议采购4.7nF
- 此元件为NTC
- HALL传感器焊接
- 应防止焊盘脱落
- R
- DTC
- Dead Time (ns) =
- 450 + 50
- 150k
